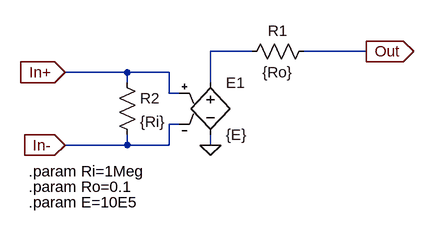
[diagram p0: schematic VCVS_Model.asc]
VCVS_Model.asc, the LTspice schematic file:
Version 4
SHEET 1 880 680
WIRE 224 64 160 64
WIRE 400 64 304 64
WIRE 32 96 -64 96
WIRE 96 96 32 96
WIRE 32 112 32 96
WIRE 160 112 160 64
WIRE 96 128 96 96
WIRE 112 128 96 128
WIRE 112 176 96 176
WIRE 32 208 32 192
WIRE 32 208 -64 208
WIRE 96 208 96 176
WIRE 96 208 32 208
WIRE 160 208 160 192
FLAG 160 208 0
FLAG -64 96 In+
IOPIN -64 96 In
FLAG -64 208 In-
IOPIN -64 208 In
FLAG 400 64 Out
IOPIN 400 64 Out
SYMBOL e 160 96 R0
SYMATTR InstName E1
SYMATTR Value {E}
SYMBOL res 320 48 R90
WINDOW 0 0 56 VBottom 2
WINDOW 3 32 56 VTop 2
SYMATTR InstName R1
SYMATTR Value {Ro}
SYMBOL res 16 96 R0
SYMATTR InstName R2
SYMATTR Value {Ri}
TEXT -120 248 Left 2 !.param Ri=1Meg
TEXT -120 272 Left 2 !.param Ro=0.1
TEXT -120 296 Left 2 !.param E=10E5

The netlist it stands for:
* VCVS_Model.asc
E1 N001 0 In+ In- {E}
R1 Out N001 {Ro}
R2 In+ In- {Ri}
.param Ri=1Meg
.param Ro=0.1
.param E=10E5
.backanno
.end